# Altium project ESP32_Demo.PrjPCB
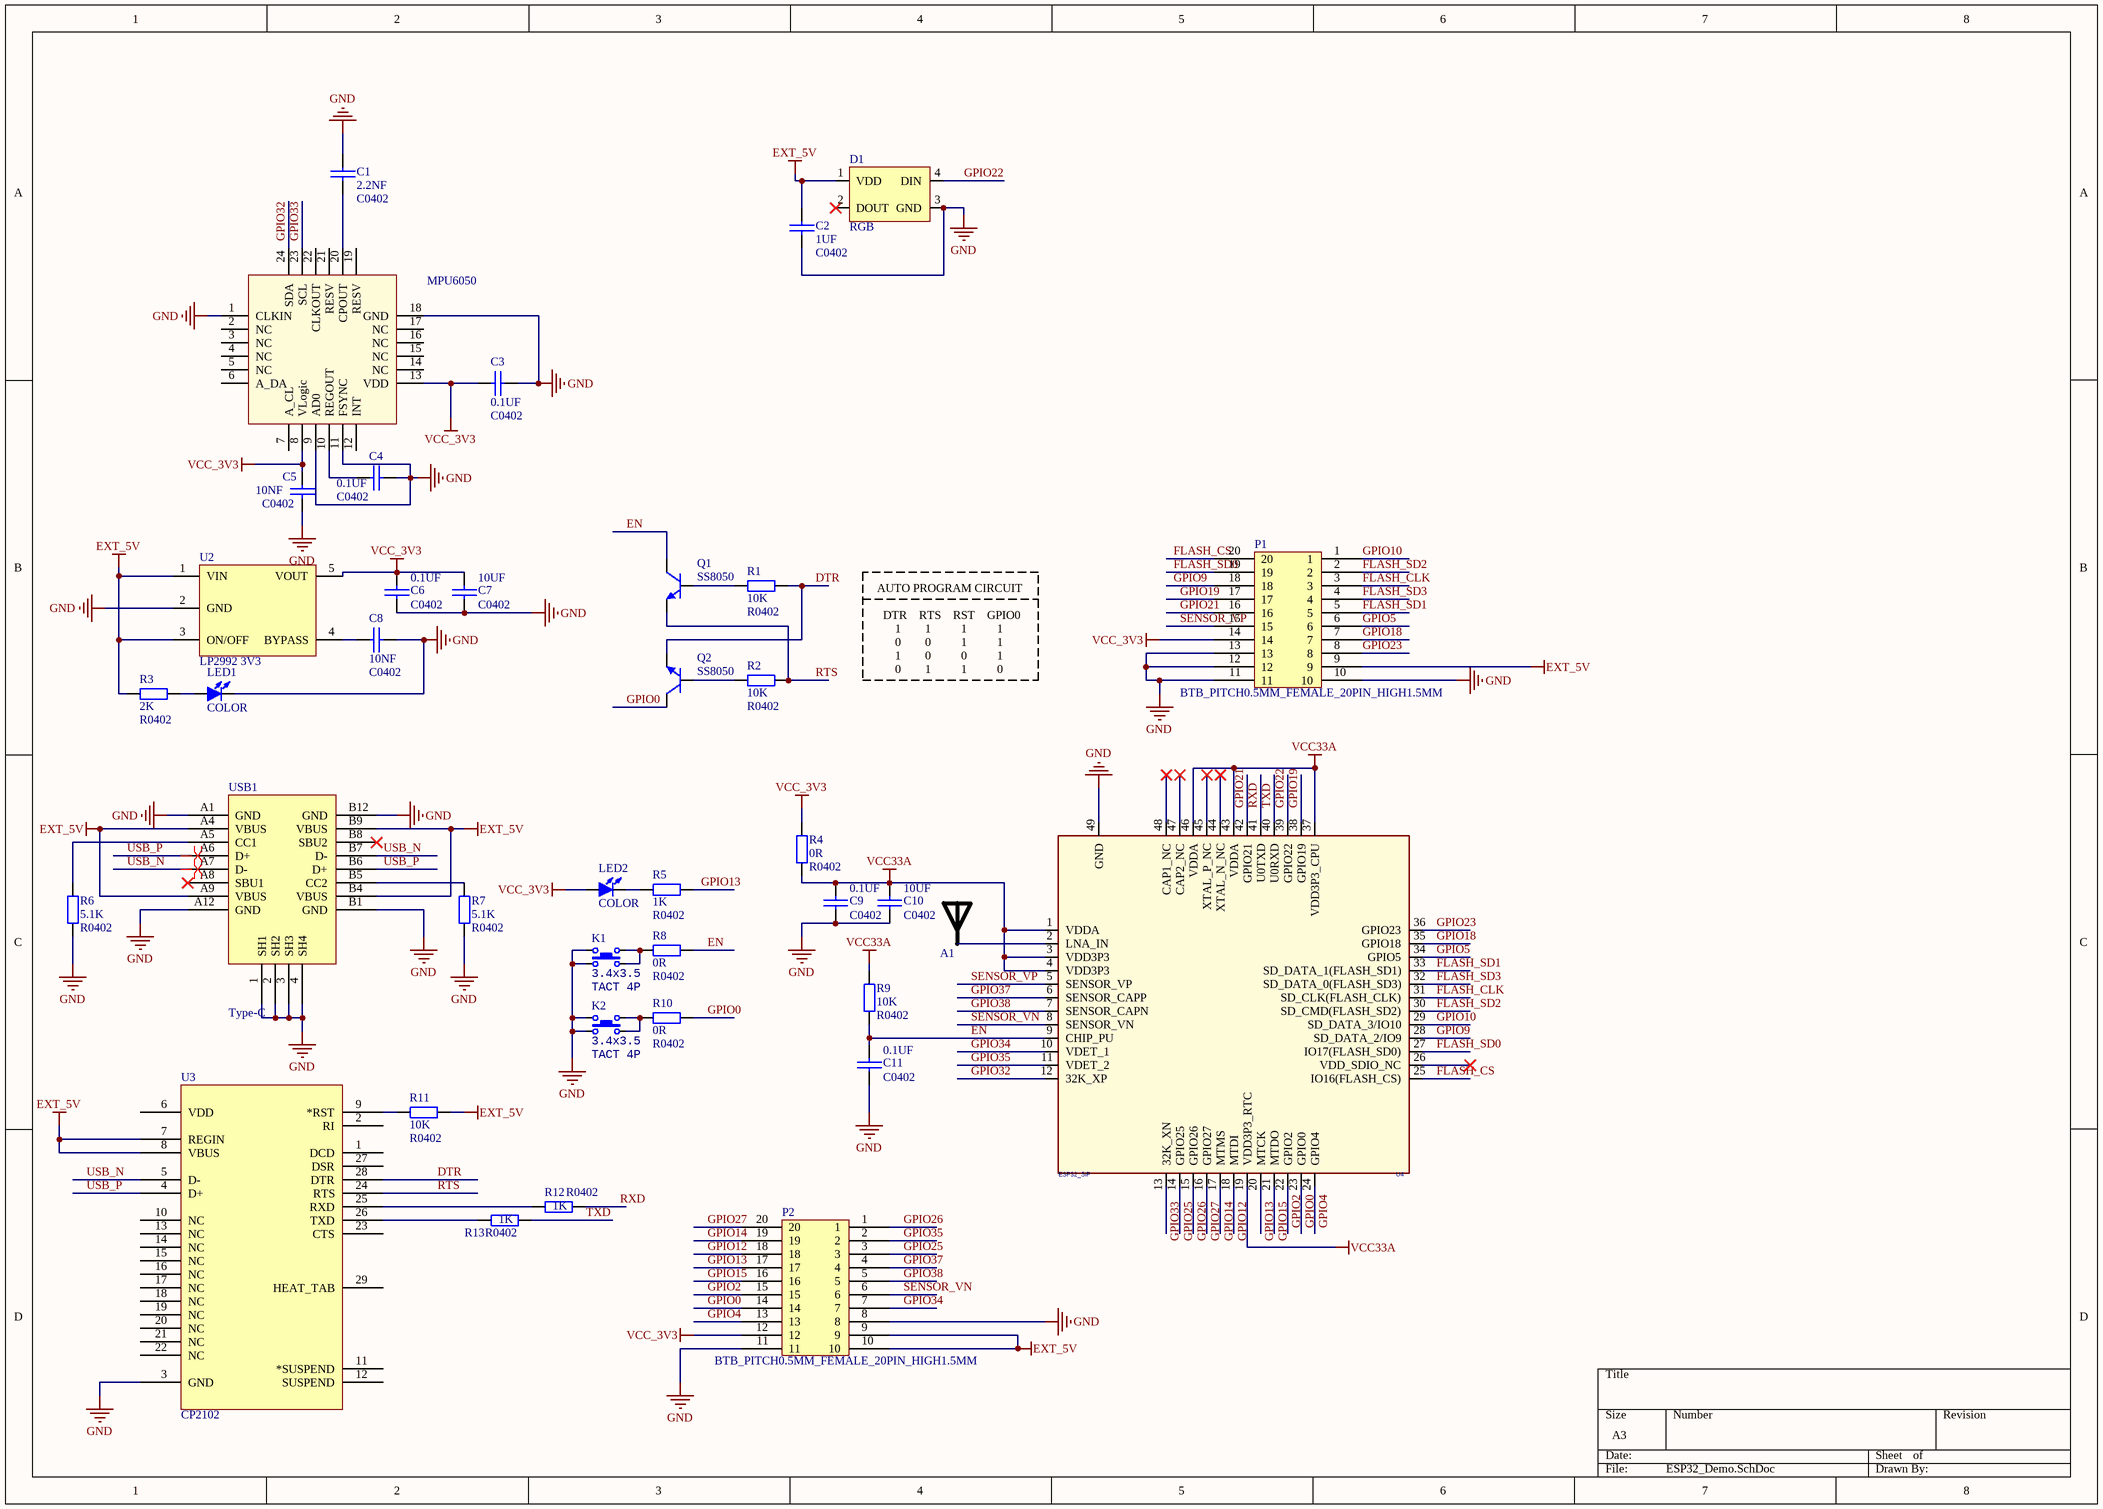
[diagram p0: ESP32_Demo.SchDoc]
1 sheet, 39 parts. Net scope: global (net labels, ports and power ports of the same name join across sheets).
Board file: ESP32_Demo.PcbDoc

## Sheet ESP32_Demo.SchDoc
size A3

### Parts
A1  RAINSUN  [ANT-Rainsun-AN5120]  (value not drawn)
C1  2.2NF  FOOTPRINT: C0402  [C 0402_L]
C2  1UF  FOOTPRINT: C0402  [C 0402_L]
C3  0.1UF  FOOTPRINT: C0402  [C 0402_L]
C4  0.1UF  FOOTPRINT: C0402  [C 0402_L]
C5  10NF  FOOTPRINT: C0402  [C 0402_L]
C6  0.1UF  FOOTPRINT: C0402  [C 0402_L]
C7  10UF  FOOTPRINT: C0402  [C 0402_L]
C8  10NF  FOOTPRINT: C0402  [C 0402_L]
C9  0.1UF  FOOTPRINT: C0402  [C 0402_L]
C10  10UF  FOOTPRINT: C0402  [C 0402_L]
C11  0.1UF  FOOTPRINT: C0402  [C 0402_L]
D1  RGB  [WS2812B]
K1  value 3.4x3.5  [ButtonTACT_3.5*3.55_90]  (hidden comment: TACT 4P)
K2  value 3.4x3.5  [ButtonTACT_3.5*3.55_90]  (hidden comment: TACT 4P)
LED1  COLOR  [LED0402]
LED2  COLOR  [LED0402]
P1  BTB_PITCH0.5MM_FEMALE_20PIN_HIGH1.5MM  [BTB_FEMALE_0.5MMPITCH_20PIN]
P2  BTB_PITCH0.5MM_FEMALE_20PIN_HIGH1.5MM  [BTB_FEMALE_0.5MMPITCH_20PIN]
Q1  SS8050  [SOT23-3N]
Q2  SS8050  [SOT23-3N]
R1  10K  FOOTPRINT: R0402  [R 0402_L]
R2  10K  FOOTPRINT: R0402  [R 0402_L]
R3  2K  FOOTPRINT: R0402  [R 0402_L]
R4  0R  FOOTPRINT: R0402  [R 0402_L]
R5  1K  FOOTPRINT: R0402  [R 0402_L]
R6  5.1K  FOOTPRINT: R0402  [R 0402_L]
R7  5.1K  FOOTPRINT: R0402  [R 0402_L]
R8  0R  FOOTPRINT: R0402  [R 0402_L]
R9  10K  FOOTPRINT: R0402  [R 0402_L]
R10  0R  FOOTPRINT: R0402  [R 0402_L]
R11  10K  FOOTPRINT: R0402  [R 0402_L]
R12  1K  FOOTPRINT: R0402  [R 0402_L]
R13  1K  FOOTPRINT: R0402  [R 0402_L]
U1  MPU6050  [QFN-24]
U2  LP2992 3V3  [SOT23-5]
U3  CP2102  [QFN-28]
U4  ESP32_SIP  [QFN-48_7X7]
USB1  Type-C  [Type-C-TOP]

### Nets
EXT_5V: C2.1 D1.1(VDD) P1.9 P2.9 P2.10 R3.2 R11.2 U2.1(VIN) U2.3(ON/OFF) U3.7(REGIN) U3.8(VBUS) USB1.A4(VBUS) USB1.A9(VBUS) USB1.B4(VBUS) USB1.B9(VBUS)
GND: C1.1 C2.2 C3.1 C4.2 C5.2 C6.1 C7.1 C8.2 C9.1 C10.1 C11.1 D1.3(GND) K1.1 K1.3 K2.1 K2.3 LED1.2(K) P1.10 P1.11 P1.12 P1.13 P2.8 P2.11 R6.2 R7.2 U1.1(CLKIN) U1.9(AD0) U1.11(FSYNC) U1.18(GND) U2.2(GND) U3.3(GND) U4.49(GND) USB1.1(SH1) USB1.2(SH2) USB1.3(SH3) USB1.4(SH4) USB1.A1(GND) USB1.A12(GND) USB1.B1(GND) USB1.B12(GND)
VCC33A: C9.2 C10.2 R4.2 R9.1 U4.1(VDDA) U4.3(VDD3P3) U4.4(VDD3P3) U4.19(VDD3P3_RTC) U4.37(VDD3P3_CPU) U4.43(VDDA) U4.46(VDDA)
VCC_3V3: C3.2 C5.1 C6.2 C7.2 LED2.1(A) P1.14 P2.12 R4.1 U1.8(VLogic) U1.13(VDD) U2.5(VOUT)
DTR: Q2.2(E) R1.2 U3.28(DTR)
EN: C11.2 Q1.3(C) R8.2 R9.2 U4.9(CHIP_PU)
FLASH_CLK: P1.3 U4.31(SD_CLK(FLASH_CLK))
FLASH_CS: P1.20 U4.25(IO16(FLASH_CS))
FLASH_SD0: P1.19 U4.27(IO17(FLASH_SD0))
FLASH_SD1: P1.5 U4.33(SD_DATA_1(FLASH_SD1))
FLASH_SD2: P1.2 U4.30(SD_CMD(FLASH_SD2))
FLASH_SD3: P1.4 U4.32(SD_DATA_0(FLASH_SD3))
GPIO0: P2.14 Q2.3(C) R10.2 U4.23(GPIO0)
GPIO2: P2.15 U4.22(GPIO2)
GPIO4: P2.13 U4.24(GPIO4)
GPIO5: P1.6 U4.34(GPIO5)
GPIO9: P1.18 U4.28(SD_DATA_2/IO9)
GPIO10: P1.1 U4.29(SD_DATA_3/IO10)
GPIO12: P2.18 U4.18(MTDI)
GPIO13: P2.17 R5.1 U4.20(MTCK)
GPIO14: P2.19 U4.17(MTMS)
GPIO15: P2.16 U4.21(MTDO)
GPIO18: P1.7 U4.35(GPIO18)
GPIO19: P1.17 U4.38(GPIO19)
GPIO21: P1.16 U4.42(GPIO21)
GPIO22: D1.4(DIN) U4.39(GPIO22)
GPIO23: P1.8 U4.36(GPIO23)
GPIO25: P2.3 U4.14(GPIO25)
GPIO26: P2.1 U4.15(GPIO26)
GPIO27: P2.20 U4.16(GPIO27)
GPIO32: U1.24(SDA) U4.12(32K_XP)
GPIO33: U1.23(SCL) U4.13(32K_XN)
GPIO34: P2.7 U4.10(VDET_1)
GPIO35: P2.2 U4.11(VDET_2)
GPIO37: P2.4 U4.6(SENSOR_CAPP)
GPIO38: P2.5 U4.7(SENSOR_CAPN)
RTS: Q1.2(E) R2.2 U3.24(RTS)
RXD: R12.2 U4.41(U0TXD)
SENSOR_VN: P2.6 U4.8(SENSOR_VN)
SENSOR_VP: P1.15 U4.5(SENSOR_VP)
TXD: R13.2 U4.40(U0RXD)
USB_N: U3.5(D-) USB1.A7(D-) USB1.B7(D-)
USB_P: U3.4(D+) USB1.A6(D+) USB1.B6(D+)
NetA1_1: A1.1 U4.2(LNA_IN)
NetC1_2: C1.2 U1.20(CPOUT)
NetC4_1: C4.1 U1.10(REGOUT)
NetC8_1: C8.1 U2.4(BYPASS)
NetK1_2: K1.2 K1.4 R8.1
NetK2_2: K2.2 K2.4 R10.1
NetLED1_1: LED1.1(A) R3.1
NetLED2_2: LED2.2(K) R5.2
NetQ1_1: Q1.1(B) R1.1
NetQ2_1: Q2.1(B) R2.1
NetR6_1: R6.1 USB1.A5(CC1)
NetR7_1: R7.1 USB1.B5(CC2)
NetR11_1: R11.1 U3.9(*RST)
NetR12_1: R12.1 U3.25(RXD)
NetR13_1: R13.1 U3.26(TXD)

Not connected (* = marked no-connect by the designer): D1 2(DOUT)*; U1 2(NC) 3(NC) 4(NC) 5(NC) 6(A_DA) 7(A_CL) 12(INT) 14(NC) 15(NC) 16(NC) 17(NC) 19(RESV) 21(RESV) 22(CLKOUT); U3 1(DCD) 2(RI) 6(VDD) 10(NC) 11(*SUSPEND) 12(SUSPEND) 13(NC) 14(NC) 15(NC) 16(NC) 17(NC) 18(NC) 19(NC) 20(NC) 21(NC) 22(NC) 23(CTS) 27(DSR) 29(HEAT_TAB); U4 26(VDD_SDIO_NC)* 44(XTAL_N_NC)* 45(XTAL_P_NC)* 47(CAP2_NC)* 48(CAP1_NC)*; USB1 A8(SBU1)* B8(SBU2)*

### Layout directives
differential pair: USB_N, USB_P

### Notes on the sheet
- AUTO PROGRAM CIRCUIT
  DTR    RTS    RST    GPIO0
  1        1          1          1
  0        0          1          1
  1        0          0          1
  0        1          1          0

### Library data of the parts
A1 = ANT-Rainsun-AP5120: 2.4GHz,5.1mm*2.0mm陶瓷天线，内置蓝牙WiFi
C1-C11 = CAP_0402: 0402无极性贴片电容; 版权归属: 源创客; BOM名称: 无极性贴片电容; 学习资源: www.ooocke.com
D1 = LED_5050_WS2812B
K1 K2 = ButtonTACT: Button; type: TACT 4P
LED1 LED2 = LED-SMD: 贴片LED; 版权归属: 源创客; BOM名称: 贴片LED; 学习资源: www.ooocke.com
Q1 Q2 = 8050-SMD: 高频放大-NPN型; 版权归属: 源创客; 属性: 40V 1.5A 1W 100MHZ; BOM名称: 高频放大-NPN型; 学习资源: www.ooocke.com
R1-R13 = RES_0402: 0402电阻
U1 = MPU6050: 六轴传感器
U2 = LP2992: LDO
U3 = CP2102: USB转TTL; PART DESC: SINGLE-CHIP USB TO UART BRIDGE, QFN28, RoHS.; MFG #1: SILICON LABS; PART NUMBER: CP2102; Value: Value; RefDes: RefDes; Type: DEV
U4 = ESP32-PICO: ESP32控制芯片
USB1 = USB-Type-C-TOP: Type-c接口